# EAGLE design CasTracker (EAGLE 9.6.2)
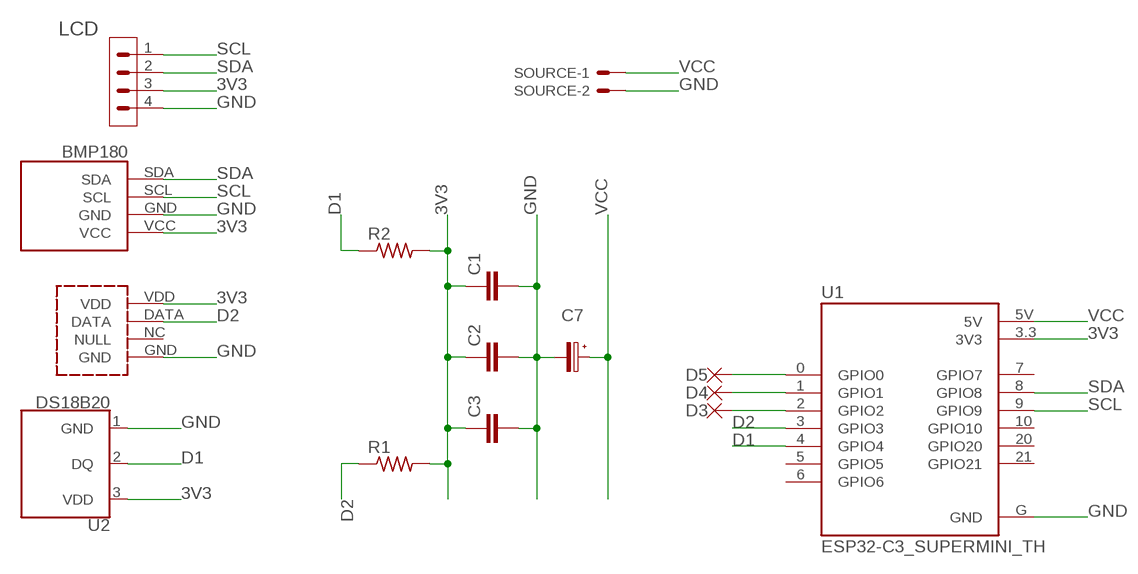
[diagram p0: schematic, sheet 1]

## Parts
BMP180  GY-68-BMP180  [GY-68-BMP180]
C1  C2.5/2  [C2.5-2]
C2  C2.5/2  [C2.5-2]
C3  C2.5/2  [C2.5-2]
C7  100u  C-POL_RADIAL-11MM-DIA  [CAPPRD508W65D1000H1100B]
D3  PAD  [2.54/1.0]
D4  PAD  [2.54/1.0]
D5  PAD  [2.54/1.0]
DHT22  DHT22  [DHT22]
LCD  PINHD-1X4/90  [1X04/90]
R1  R-US_0204/2V  [0204V]
R2  R-US_0204/2V  [0204V]
SOURCE  CON-MOLEX_22-23-2021  [CON-MOLEX_22-23-2021]
U1  ESP32-C3_SUPERMINI_TH  [MODULE_ESP32-C3_SUPERMINI_TH]
U2  DS18B20  [TO-92-AMMO]

## Nets
3V3: BMP180.VCC C1.1 C2.1 C3.1 DHT22.VDD LCD.3 R1.2 R2.2 U1.3.3(3V3) U2.3(VDD)
D1: R2.1 U1.4(GPIO4) U2.2(DQ)
D2: DHT22.DATA R1.1 U1.3(GPIO3)
GND: BMP180.GND C1.2 C2.2 C3.2 C7.2(-) DHT22.GND LCD.4 SOURCE.2 U1.G(GND) U2.1(GND)
PAD1: D5.1(P) U1.0(GPIO0)
PAD2: D4.1(P) U1.1(GPIO1)
PAD3: D3.1(P) U1.2(GPIO2)
SCL: BMP180.SCL LCD.1 U1.9(GPIO9)
SDA: BMP180.SDA LCD.2 U1.8(GPIO8)
VCC: C7.1(+) SOURCE.1 U1.5V
Unconnected: DHT22.NC(NULL) U1.5(GPIO5) U1.6(GPIO6) U1.7(GPIO7) U1.10(GPIO10) U1.20(GPIO20) U1.21(GPIO21)

## Library data of the parts
BMP180 = Biblioteca:GY-68-BMP180
C1-C3 = capacitor-wima:C: CAPACITOR naming: grid - package width
C7 = Capacitor:C-POL: Capacitor Polarised - Generic; CATEGORY: Capacitor; PACKAGE_SIZE: 11MM-DIA; PACKAGE_TYPE: Through Hole; SUBCATEGORY: Aluminum Electrolytic Capacitors; TYPE: Radial Can
D3-D5 = Connector:PAD: Through-Hole Pad; CATEGORY: Connectors; DESCRIPTION: Pad with 2.54 mm diamater and 1mm drill; PACKAGE_SIZE: NA; PACKAGE_TYPE: Through Hole; PITCH: NA
DHT22 = DHT22:DHT22: Check availability <https://pricing.snapeda.com/parts/DHT22/Aosong%20Electronics/view-part?ref=eda>; AVAILABILITY: Not in stock; CHECK_PRICES: https://www.snapeda.com/parts/DHT22/Aosong+Electronics/view-part/?ref=eda; DESCRIPTION: Módulo/sensor de umidade e temperatura do tipo capacitivo; MF: Aosong Electronics; MP: DHT22; PACKAGE: Package; PRICE: None; SNAPEDA_LINK: https://www.snapeda.com/parts/DHT22/Aosong+Electronics/view-part/?ref=snap
LCD = Connector:PINHD-1X4: Pin Header; CATEGORY: Connectors; DESCRIPTION: Header-Right Angle-4 Position; PACKAGE_TYPE: Through Hole; PITCH: 0.100" (2.54mm); SUBCATEGORY: Headers; TYPE: Male Pins
R1 R2 = rcl:R-US_: RESISTOR, American symbol; SPICEPREFIX: R
SOURCE = KK22232051:CON-MOLEX_22-23-2021: Check availability <https://pricing.snapeda.com/parts/22-23-2021/Molex/view-part?ref=eda>; AVAILABILITY: In Stock; CHECK_PRICES: https://www.snapeda.com/parts/22-23-2021/Molex/view-part/?ref=eda; DESCRIPTION: Conector Retrátil InterConnSys 2Cont Thru-Hole KKSeries 0,10InPin-Spng Reto | Molex Incorporated 22/23/2021; MF: Molex; MP: 22-23-2021; PACKAGE: None; PRICE: None; SNAPEDA_LINK: https://www.snapeda.com/parts/22-23-2021/Molex/view-part/?ref=snap
U1 = ESP32-C3_SUPERMINI_TH:ESP32-C3_SUPERMINI_TH: Check availability <https://pricing.snapeda.com/parts/ESP32-C3%20SuperMini_TH/Espressif%20Systems/view-part?ref=eda>; AVAILABILITY: Not in stock; CHECK_PRICES: https://www.snapeda.com/parts/ESP32-C3%20SuperMini_TH/Espressif+Systems/view-part/?ref=eda; DESCRIPTION: Super tiny ESP32-C3 board; MF: Espressif Systems; MP: ESP32-C3 SuperMini_TH; PACKAGE: Package; PRICE: None; SNAPEDA_LINK: https://www.snapeda.com/parts/ESP32-C3%20SuperMini_TH/Espressif+Systems/view-part/?ref=snap
U2 = SparkFun-Sensors:DS18B20: Dallas/Maxim DS18B20 1-Wire Temperature Sensor The DS18B20 reports degrees C with 9 to 12-bit precision, -55C to 125C (+/-0.5C). Each sensor has a unique 64-Bit Serial number etched into it - allows for a huge number of sensors to be used on one data bus. Datasheet <http://datasheets.maximintegrated.com/en/ds/DS18B20.pdf> SparkFun Products One Wire Digital Temperature Sensor - DS18B20 <https://www.sparkfun.com/products/245> (SEN-00245); STORE_ID: SEN-00245

## Board
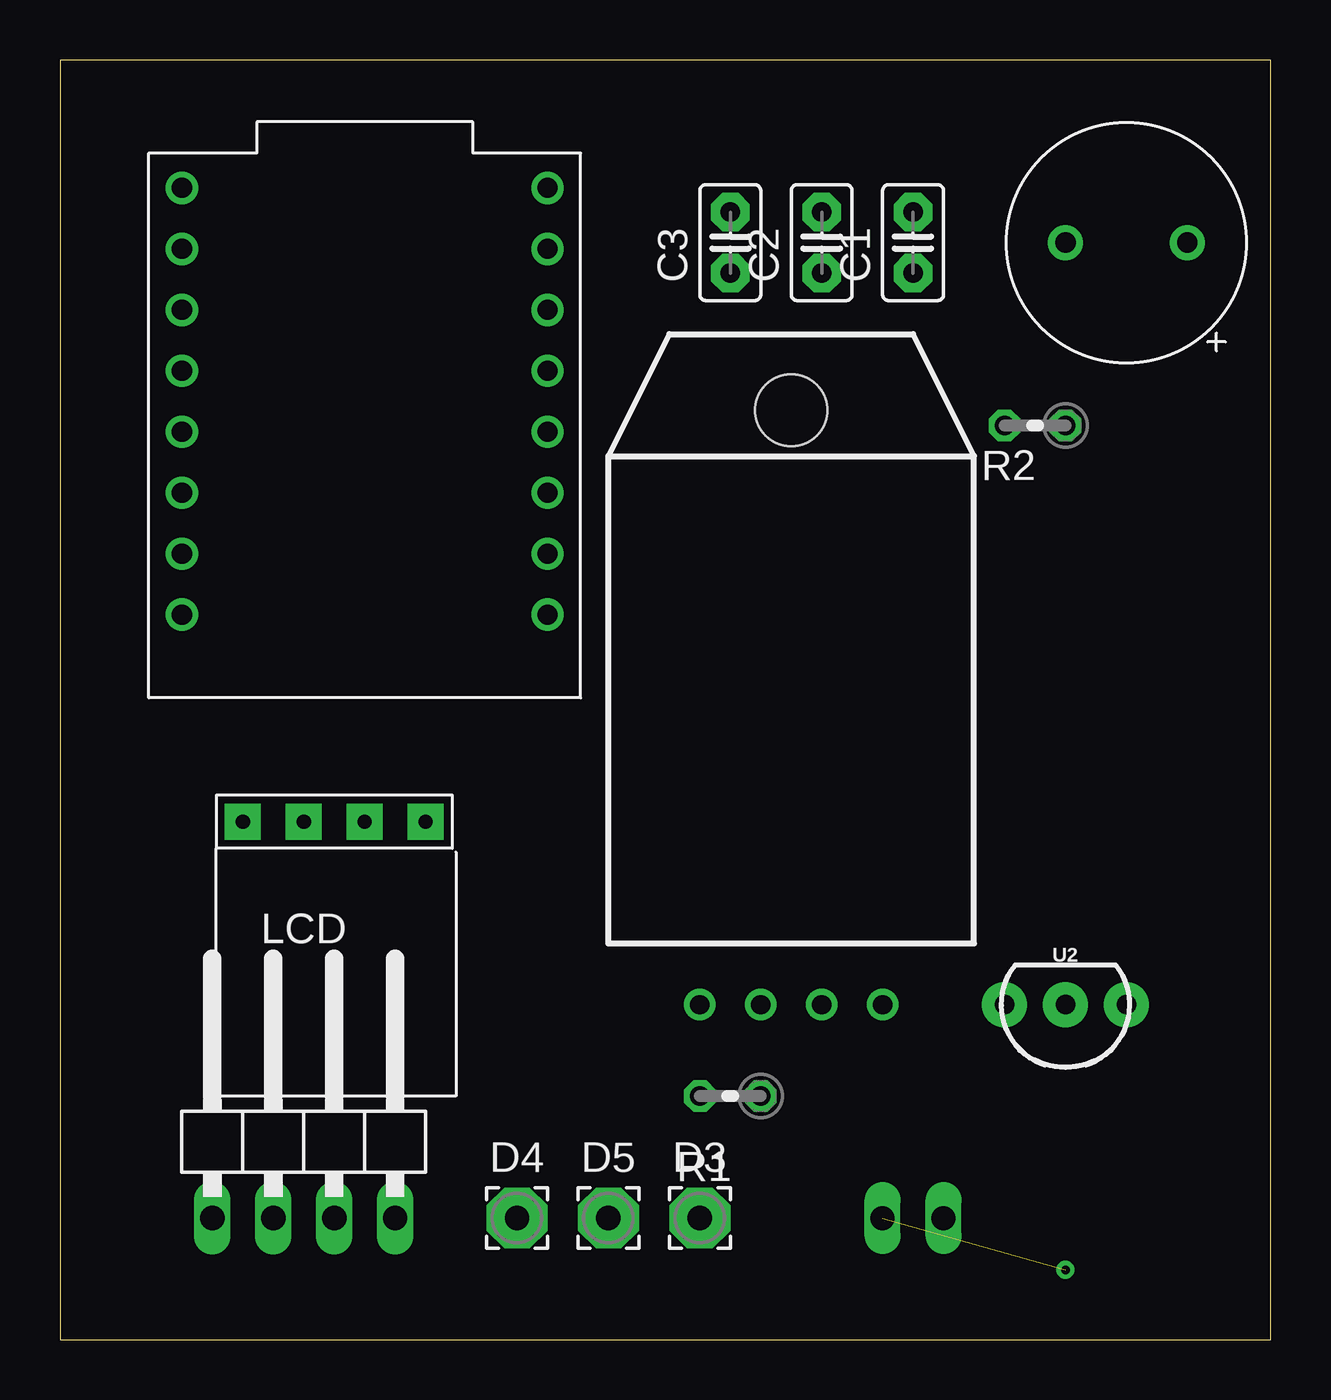
[diagram p1: board, top side]
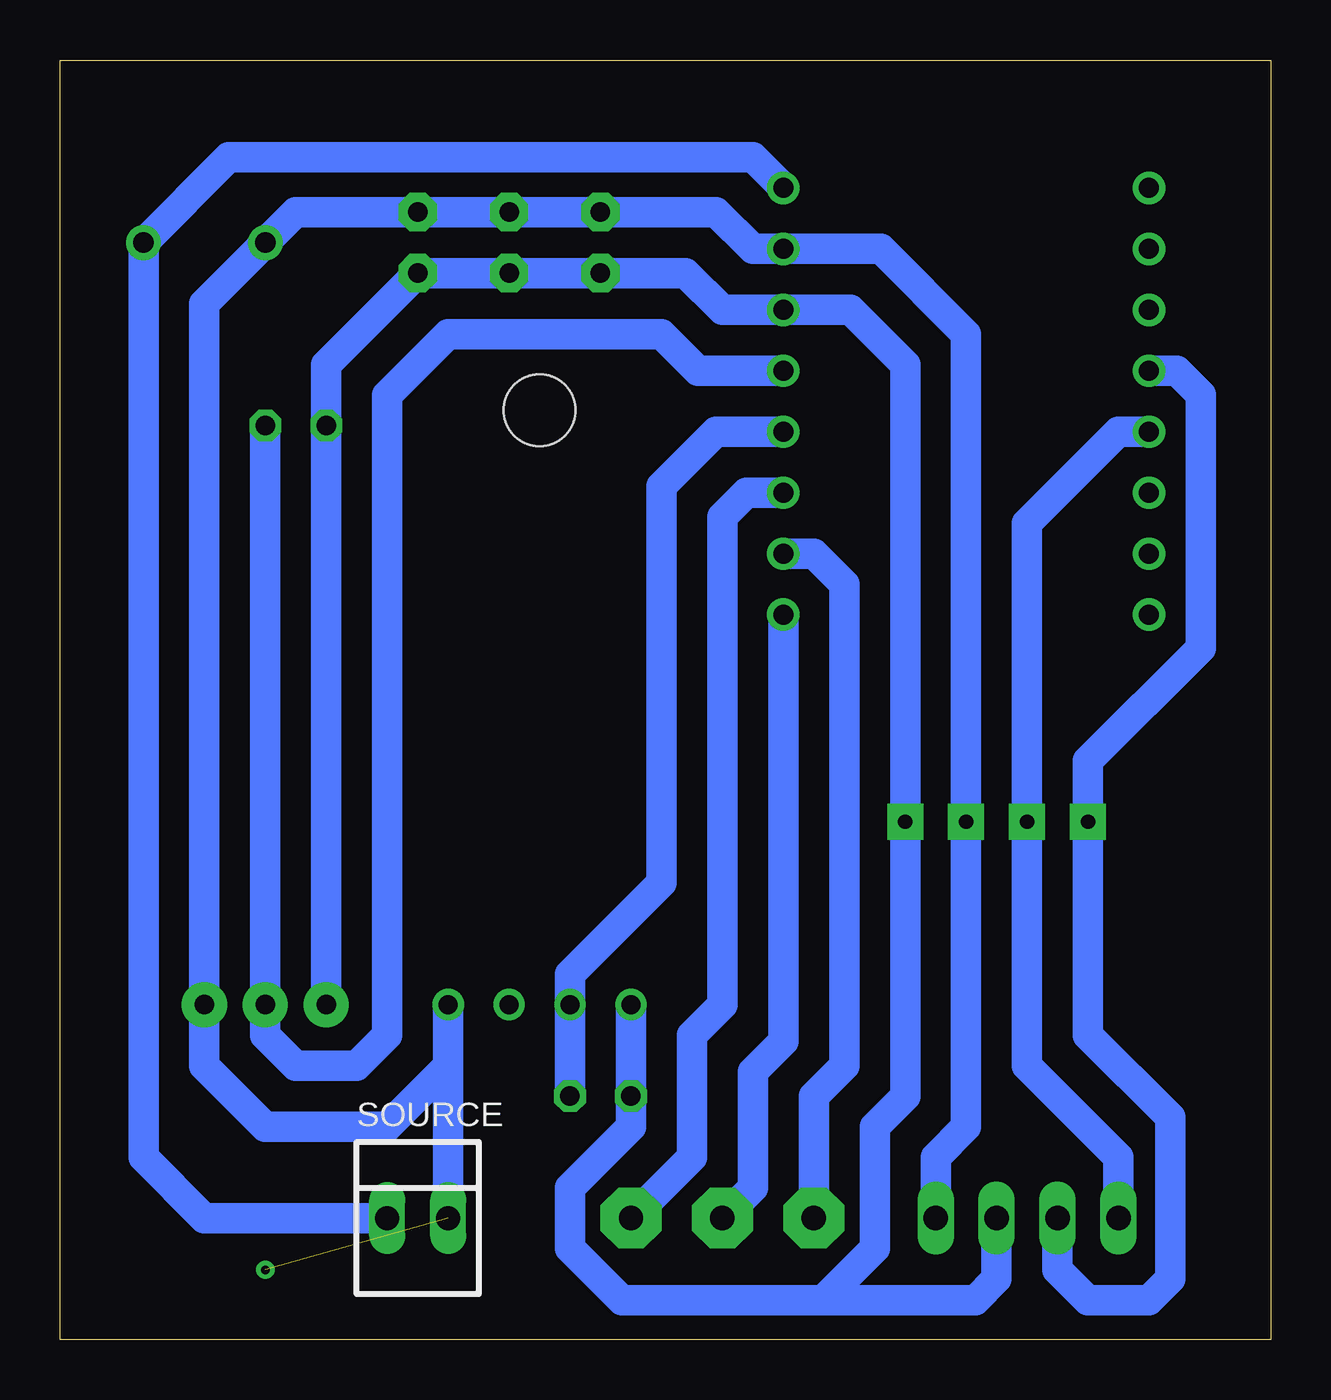
[diagram p2: board, bottom side, seen from below]

Size 50.47 x 53.33 mm. Coordinates in mm from the lower left corner, seen from the top.
Outline: 0,53.33 0,0 50.47,0 50.47,53.33 0,53.33
Copper layers (1*16): Top 0.035mm / dielectric 1.5mm / Bottom 0.035mm
Design rules "default *": minimum track width 6mil, minimum drill 0.35mm, track to track 6mil, track to pad 6mil, pad to pad 6mil, via to via 6mil, smd to smd 6mil, copper to edge 40mil, drill to drill 6mil, minimum pad ring 10mil, minimum via ring 8mil, stop-mask expansion 4mil, vias tented up to drill 0mil, thermal gap 10mil

### Footprints (pad centres in the part's own frame; a part is rotated, then mirrored left to right if it is on the bottom)
GY-68-BMP180 = drill 0.6 pad 1.5 square: GND -6.35,7.62; SCL -6.35,5.08; SDA -6.35,2.54; VCC -6.35,10.16
C2.5-2 = drill 0.813 pad 1.6 octagon: 1 -1.27,0; 2 1.27,0
CAPPRD508W65D1000H1100B = drill 0.85 pad 1.45: 1 -2.54,0; 2 2.54,0
2.54/1.0 = drill 1.016 pad 2.54 octagon: 1 0,0
DHT22 = drill 0.8: DATA -1.27,0; GND 3.81,0; NC 1.27,0; VDD -3.81,0 | hole 3: 0,24.765
1X04/90 = drill 1.016 long: 1 -3.81,-3.81; 2 -1.27,-3.81; 3 1.27,-3.81; 4 3.81,-3.81
0204V = drill 0.813 octagon: 1 -1.27,0; 2 1.27,0
CON-MOLEX_22-23-2021 = drill 1 long: 1 -1.27,0; 2 1.27,0
MODULE_ESP32-C3_SUPERMINI_TH = drill 0.84: 0 7.62,-7.88; 1 7.62,-5.34; 2 7.62,-2.8; 3 7.62,-0.26; 3.3 7.62,4.82; 4 7.62,2.28; 5 -7.62,9.9; 5V 7.62,9.9; 6 -7.62,7.36; 7 -7.62,4.82; 8 -7.62,2.28; 9 -7.62,-0.26; 10 -7.62,-2.8; 20 -7.62,-5.34; 21 -7.62,-7.88; G 7.62,7.36
TO-92-AMMO = drill 0.813 pad 1.88: 1 -2.54,0; 2 0,0; 3 2.54,0

### Placement (x,y rotation side)
BMP180  5.08,15.24 270 top
C1  35.56,45.72 90 top
C2  31.75,45.72 90 top
C3  27.94,45.72 90 top
C7  44.45,45.72 180 top
D3  26.67,5.08 0 top
D4  19.05,5.08 0 top
D5  22.86,5.08 0 top
DHT22  30.48,13.97 0 top
LCD  10.16,8.89 0 top
R1  27.94,10.16 180 top
R2  40.64,38.1 180 top
SOURCE  35.56,5.08 0 bottom
U1  12.7,38.1 0 top
U2  41.91,13.97 180 top

### Tracks (layer width: path | path; a pad name or v marks a point on that pad's centre or on a via)
3V3
  Bottom 1.27: DHT22.VDD R1.2 26.67,8.89 29.21,6.35 29.21,3.81 27.05,1.65 18.67,1.65 | LCD.3 11.43,2.54 12.32,1.65 18.67,1.65 | 18.67,1.65 16.51,3.81 16.51,8.89 15.24,10.16 BMP180.VCC 15.24,40.64 17.52,42.92 U1.3.3 22.86,42.92 24.39,44.45 C3.1 C2.1 C1.1 39.37,40.64 R2.2 U2.3
D1
  Bottom 1.27: U1.4 23.87,40.38 25.4,41.91 34.29,41.91 36.83,39.37 36.83,12.7 38.1,11.43 40.64,11.43 41.91,12.7 U2.2 R2.1
D2
  Bottom 1.27: U1.3 23.12,37.84 25.4,35.56 25.4,19.05 29.21,15.24 DHT22.DATA R1.1
GND  (via drill 0.35)  (1 unrouted)
  Bottom 1.27: LCD.4 13.97,7.62 12.7,8.89 BMP180.GND 12.7,41.91 16.25,45.46 U1.G 21.59,45.46 23.12,46.99 C3.2 C2.2 C1.2 40.64,46.99 C7.2 44.45,43.18 U2.1 44.45,11.43 41.91,8.89 36.83,8.89 34.29,11.43 | DHT22.GND 34.29,11.43 | SOURCE.2 34.29,11.43
  other vias: 41.91,2.92
PAD1
  Bottom 1.27: U1.0 20.32,12.44 21.59,11.17 21.59,6.35 D5.1
PAD2
  Bottom 1.27: U1.1 19.05,32.76 17.78,31.49 17.78,11.43 19.05,10.16 D4.1
PAD3
  Bottom 1.27: D3.1 24.13,7.62 24.13,12.7 22.86,13.97 22.86,34.29 21.85,35.3 U1.2
SCL
  Bottom 1.27: LCD.1 6.35,7.62 10.16,11.43 BMP180.SCL 10.16,34.03 6.35,37.84 U1.9
SDA
  Bottom 1.27: U1.8 3.92,40.38 2.92,39.38 2.92,28.83 7.62,24.13 BMP180.SDA 7.62,12.7 4.19,9.27 4.19,2.54 5.08,1.65 7.62,1.65 8.89,2.92 LCD.2
VCC
  Bottom 1.27: U1.5V 21.59,49.27 43.44,49.27 C7.1 46.99,7.62 44.45,5.08 SOURCE.1